# Altium project DH_Electronics.PrjPcb
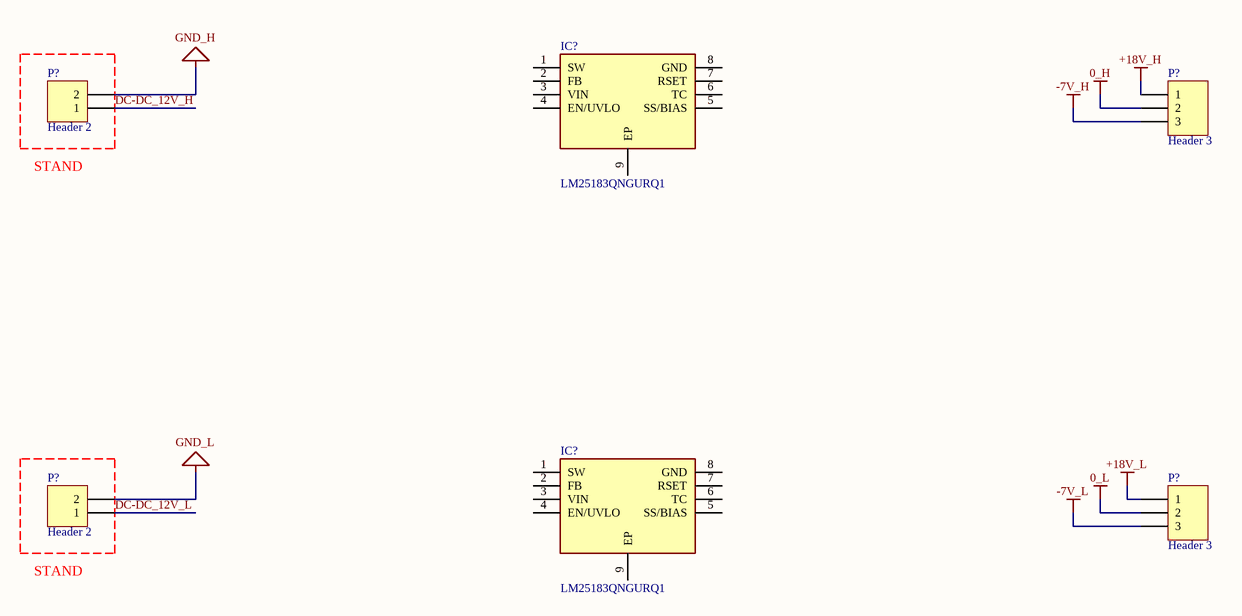
[diagram p0: Isolated_Gate_DCDC.SchDoc]
7 sheets, 147 parts. Net scope: flat (ports and power ports of the same name join across sheets).
Sheets:
  LV_ACDC_Converter.SchDoc
  Isolated_Gate_DCDC.SchDoc
  Gate_Drive.SchDoc
  Control_Unit.SchDoc
  Inteligent_IGBT.SchDoc
  HV_Bus.SchDoc
  Phase_Capacitor.SchDoc

## Sheet LV_ACDC_Converter.SchDoc
size A3

## Sheet Isolated_Gate_DCDC.SchDoc
size A3

### Parts
(Parts that share a designator on the sheet are numbered #1, #2 ... from top to bottom, then left to right.)
IC?#1  LM25183QNGURQ1  [SON80P400X400X80-9N]
IC?#2  LM25183QNGURQ1  [SON80P400X400X80-9N]
P?#1  Header 3  [HDR1X3]
P?#2  Header 2  [HDR1X2]
P?#3  Header 3  [HDR1X3]
P?#4  Header 2  [HDR1X2]

### Nets
0_H: P?#1.2  [project net H_EMITTER]
0_L: P?#3.2  [project net L_EMITTER]
+18V_H: P?#1.1
+18V_L: P?#3.1
-7V_H: P?#1.3
-7V_L: P?#3.3
GND_H: P?#2.2
GND_L: P?#4.2
DC-DC_12V_H: P?#2.1
DC-DC_12V_L: P?#4.1

Not connected (* = marked no-connect by the designer): IC?#1 1(SW) 2(FB) 3(VIN) 4(EN/UVLO) 5(SS/BIAS) 6(TC) 7(RSET) 8(GND) 9(EP); IC?#2 1(SW) 2(FB) 3(VIN) 4(EN/UVLO) 5(SS/BIAS) 6(TC) 7(RSET) 8(GND) 9(EP)

### Notes on the sheet
- STAND

### Library data of the parts
IC?#1 IC?#2 = LM25183QNGURQ1: Integrated Circuit; Manufacturer_Name: Texas Instruments; Datasheet Link: https://www.ti.com/lit/ds/symlink/lm25183-q1.pdf?ts=1601923557129&ref_url=https%253A%252F%252Fwww.ti.com%252Fstore%252Fti%252Fen%252Fp%252Fproduct%252F%253Fp%253DLM25183QNGURQ1%2526keyMatch%253DLM25183QNGURQ1%2526tisearch%253DSearch-EN-everything%2526usec; Height: 0.8mm; Manufacturer_Part_Number: LM25183QNGURQ1
P?#1 P?#3 = Header 3: Header, 3-Pin; LatestRevisionDate: 17-Jul-2002; LatestRevisionNote: Re-released for DXP Platform.; Publisher: Altium Limited
P?#2 P?#4 = Header 2: Header, 2-Pin; LatestRevisionDate: 17-Jul-2002; LatestRevisionNote: Re-released for DXP Platform.; Publisher: Altium Limited

## Sheet Gate_Drive.SchDoc
size A2; DrawnBy: Novikov M.I.
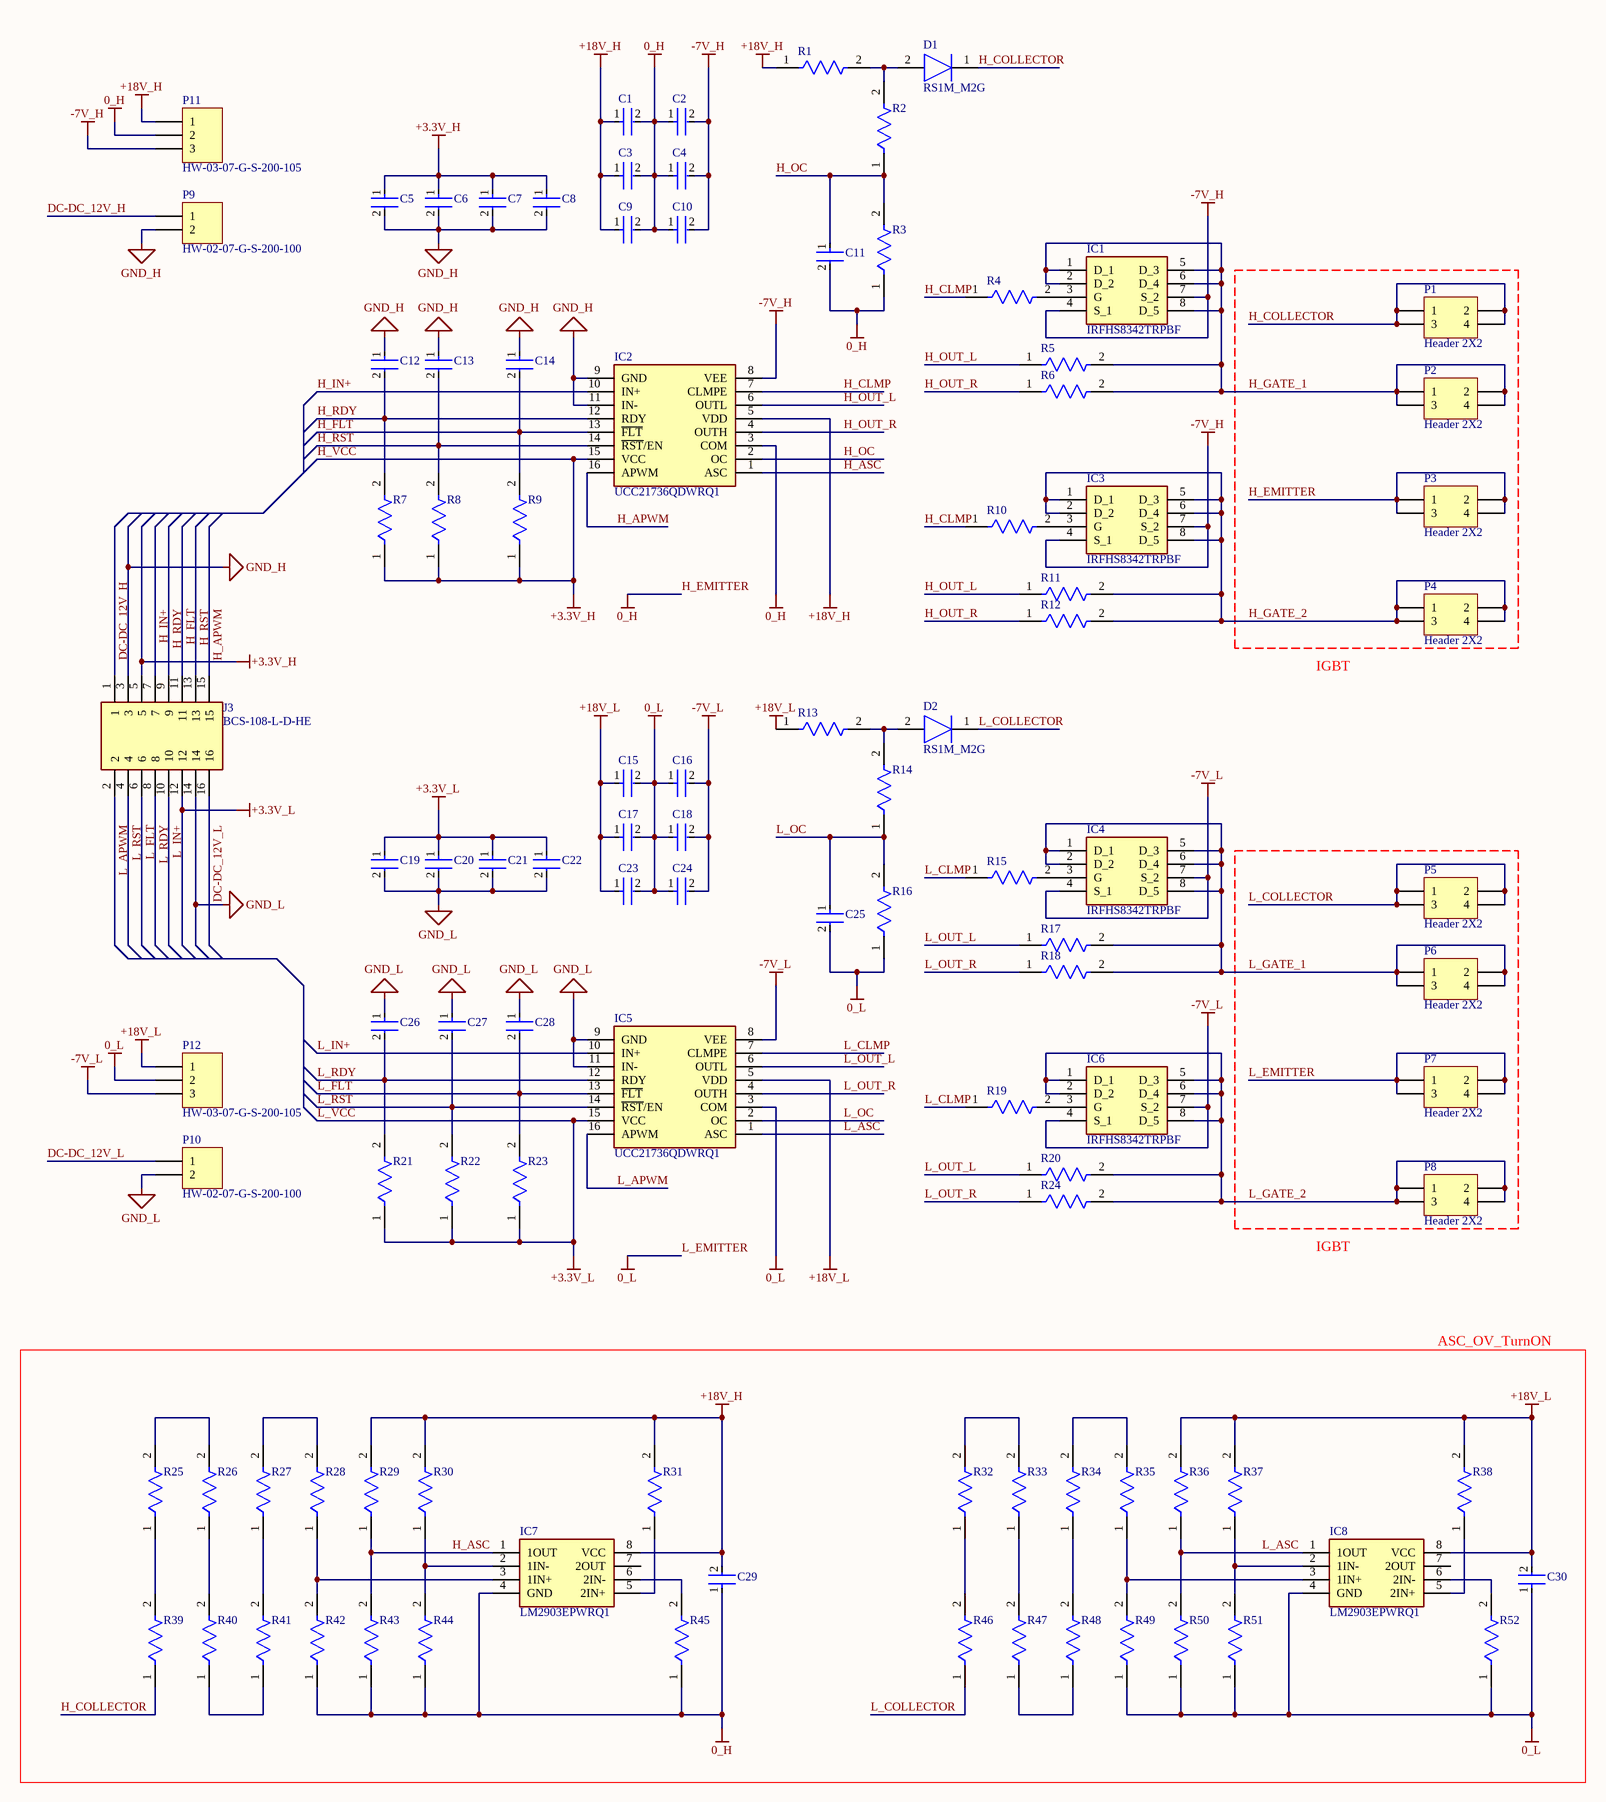
[diagram p1: Gate_Drive.SchDoc]

### Parts
(Parts that share a designator on the sheet are numbered #1, #2 ... from top to bottom, then left to right.)
C1#1  CGA5L2NP01H104J160AA  [FP-CGA5L-0_3-0_1-IPC_B]  (value not drawn)
C2#1  CGA5L2NP01H104J160AA  [FP-CGA5L-0_3-0_1-IPC_B]  (value not drawn)
C3#1  CGA6P1X8R1E106K250AC  [FP-CGA6P-IPC_B]  (value not drawn)
C4#1  CGA6P1X8R1E106K250AC  [FP-CGA6P-IPC_B]  (value not drawn)
C5  GCJ21BL81E105KA01L  [FP-GCJ21B-0_3-IPC_B]  (value not drawn)
C6  GCJ21BL81E105KA01L  [FP-GCJ21B-0_3-IPC_B]  (value not drawn)
C7  GCJ21BL81H104KA01L  [FP-GCJ21B-0_3-IPC_B]  (value not drawn)
C8  GCJ21BL81H104KA01L  [FP-GCJ21B-0_3-IPC_B]  (value not drawn)
C9  CGA6P1X8R1E106K250AC  [FP-CGA6P-IPC_B]  (value not drawn)
C10  CGA6P1X8R1E106K250AC  [FP-CGA6P-IPC_B]  (value not drawn)
C11  CGA4C4NP02W122J060AA  [FP-CGA4J-IPC_B]  (value not drawn)
C12  C0805C101J5HACAUTO  [FP-C0805C-DN-IPC_B]  (value not drawn)
C13  C0805C101J5HACAUTO  [FP-C0805C-DN-IPC_B]  (value not drawn)
C14  C0805C101J5HACAUTO  [FP-C0805C-DN-IPC_B]  (value not drawn)
C15  CGA5L2NP01H104J160AA  [FP-CGA5L-0_3-0_1-IPC_B]  (value not drawn)
C16  CGA5L2NP01H104J160AA  [FP-CGA5L-0_3-0_1-IPC_B]  (value not drawn)
C17  CGA6P1X8R1E106K250AC  [FP-CGA6P-IPC_B]  (value not drawn)
C18  CGA6P1X8R1E106K250AC  [FP-CGA6P-IPC_B]  (value not drawn)
C19  GCJ21BL81E105KA01L  [FP-GCJ21B-0_3-IPC_B]  (value not drawn)
C20  GCJ21BL81E105KA01L  [FP-GCJ21B-0_3-IPC_B]  (value not drawn)
C21  GCJ21BL81H104KA01L  [FP-GCJ21B-0_3-IPC_B]  (value not drawn)
C22  GCJ21BL81H104KA01L  [FP-GCJ21B-0_3-IPC_B]  (value not drawn)
C23  CGA6P1X8R1E106K250AC  [FP-CGA6P-IPC_B]  (value not drawn)
C24  CGA6P1X8R1E106K250AC  [FP-CGA6P-IPC_B]  (value not drawn)
C25  CGA4C4NP02W122J060AA  [FP-CGA4J-IPC_B]  (value not drawn)
C26  C0805C101J5HACAUTO  [FP-C0805C-DN-IPC_B]  (value not drawn)
C27  C0805C101J5HACAUTO  [FP-C0805C-DN-IPC_B]  (value not drawn)
C28  C0805C101J5HACAUTO  [FP-C0805C-DN-IPC_B]  (value not drawn)
C29  CGA5L2NP01H104J160AA  [FP-CGA5L-0_3-0_1-IPC_B]  (value not drawn)
C30  CGA5L2NP01H104J160AA  [FP-CGA5L-0_3-0_1-IPC_B]  (value not drawn)
D1  RS1M_M2G  [DIOM5126X250N]
D2  RS1M_M2G  [DIOM5126X250N]
IC1  IRFHS8342TRPBF  [PQFN(2X2)]
IC2  UCC21736QDWRQ1  [SOIC127P1030X265-16N]
IC3  IRFHS8342TRPBF  [PQFN(2X2)]
IC4  IRFHS8342TRPBF  [PQFN(2X2)]
IC5  UCC21736QDWRQ1  [SOIC127P1030X265-16N]
IC6  IRFHS8342TRPBF  [PQFN(2X2)]
IC7  LM2903EPWRQ1  [SOP65P640X120-8N]
IC8  LM2903EPWRQ1  [SOP65P640X120-8N]
J3#1  BCS-108-L-D-HE  [BCS-108-L-D-HE]
P1  Header 2X2  [HDR2X2]
P2  Header 2X2  [HDR2X2]
P3  Header 2X2  [HDR2X2]
P4  Header 2X2  [HDR2X2]
P5  Header 2X2  [HDR2X2]
P6  Header 2X2  [HDR2X2]
P7  Header 2X2  [HDR2X2]
P8  Header 2X2  [HDR2X2]
P9  HW-02-07-G-S-200-100  [PCBComponent_1]
P10  HW-02-07-G-S-200-100  [PCBComponent_1]
P11  HW-03-07-G-S-200-105  [PCBComponent_1]
P12  HW-03-07-G-S-200-105  [PCBComponent_1]
R1#1  CRCW08055K60FKEA  [FP-CRCW0805-e3-IPC_B]  (value not drawn)
R2#1  CRCW080510K0FKEA  [FP-CRCW0805-e3-IPC_B]  (value not drawn)
R3#1  CRCW08051K60JNEA  [FP-CRCW0805-e3-IPC_B]  (value not drawn)
R4#1  CRCW080522R0FKEA  [FP-CRCW0805-e3-IPC_C]  (value not drawn)
R5#1  CRCW25124R70JNEG  [FP-CRCW2512-e3-IPC_B]  (value not drawn)
R6#1  CRCW25124R30JNEG  [FP-CRCW2512-e3-IPC_B]  (value not drawn)
R7#1  CRCW08055K60FKEA  [FP-CRCW0805-e3-IPC_B]  (value not drawn)
R8#1  CRCW08055K60FKEA  [FP-CRCW0805-e3-IPC_B]  (value not drawn)
R9  CRCW08055K60FKEA  [FP-CRCW0805-e3-IPC_B]  (value not drawn)
R10  CRCW080522R0FKEA  [FP-CRCW0805-e3-IPC_C]  (value not drawn)
R11  CRCW25124R70JNEG  [FP-CRCW2512-e3-IPC_B]  (value not drawn)
R12  CRCW25124R30JNEG  [FP-CRCW2512-e3-IPC_B]  (value not drawn)
R13  CRCW08055K60FKEA  [FP-CRCW0805-e3-IPC_B]  (value not drawn)
R14  CRCW080510K0FKEA  [FP-CRCW0805-e3-IPC_B]  (value not drawn)
R15  CRCW080522R0FKEA  [FP-CRCW0805-e3-IPC_C]  (value not drawn)
R16  CRCW08051K60JNEA  [FP-CRCW0805-e3-IPC_B]  (value not drawn)
R17  CRCW25124R70JNEG  [FP-CRCW2512-e3-IPC_B]  (value not drawn)
R18  CRCW25124R30JNEG  [FP-CRCW2512-e3-IPC_B]  (value not drawn)
R19  CRCW080522R0FKEA  [FP-CRCW0805-e3-IPC_C]  (value not drawn)
R20  CRCW25124R70JNEG  [FP-CRCW2512-e3-IPC_B]  (value not drawn)
R21  CRCW08055K60FKEA  [FP-CRCW0805-e3-IPC_B]  (value not drawn)
R22  CRCW08055K60FKEA  [FP-CRCW0805-e3-IPC_B]  (value not drawn)
R23  CRCW08055K60FKEA  [FP-CRCW0805-e3-IPC_B]  (value not drawn)
R24  CRCW25124R30JNEG  [FP-CRCW2512-e3-IPC_B]  (value not drawn)
R25  RT0805BRD07200KL  [FP-RT0805-IPC_B]  (value not drawn)
R26  RT0805BRD07200KL  [FP-RT0805-IPC_B]  (value not drawn)
R27  RT0805BRD07200KL  [FP-RT0805-IPC_B]  (value not drawn)
R28  RT0805BRD07200KL  [FP-RT0805-IPC_B]  (value not drawn)
R29  CRCW080510K0FKEA  [FP-CRCW0805-e3-IPC_B]  (value not drawn)
R30  CRCW080510K0FKEA  [FP-CRCW0805-e3-IPC_B]  (value not drawn)
R31  CRCW080510K0FKEA  [FP-CRCW0805-e3-IPC_B]  (value not drawn)
R32  RT0805BRD07200KL  [FP-RT0805-IPC_B]  (value not drawn)
R33  RT0805BRD07200KL  [FP-RT0805-IPC_B]  (value not drawn)
R34  RT0805BRD07200KL  [FP-RT0805-IPC_B]  (value not drawn)
R35  RT0805BRD07200KL  [FP-RT0805-IPC_B]  (value not drawn)
R36  CRCW080510K0FKEA  [FP-CRCW0805-e3-IPC_B]  (value not drawn)
R37  CRCW080510K0FKEA  [FP-CRCW0805-e3-IPC_B]  (value not drawn)
R38  CRCW080510K0FKEA  [FP-CRCW0805-e3-IPC_B]  (value not drawn)
R39  RT0805BRD07200KL  [FP-RT0805-IPC_B]  (value not drawn)
R40  RT0805BRD07200KL  [FP-RT0805-IPC_B]  (value not drawn)
R41  RT0805BRD07200KL  [FP-RT0805-IPC_B]  (value not drawn)
R42  CRCW080510K0FKEA  [FP-CRCW0805-e3-IPC_B]  (value not drawn)
R43  CRCW08055K60FKEA  [FP-CRCW0805-e3-IPC_B]  (value not drawn)
R44  CRCW08055K60FKEA  [FP-CRCW0805-e3-IPC_B]  (value not drawn)
R45  CRCW080510K0FKEA  [FP-CRCW0805-e3-IPC_B]  (value not drawn)
R46  RT0805BRD07200KL  [FP-RT0805-IPC_B]  (value not drawn)
R47  RT0805BRD07200KL  [FP-RT0805-IPC_B]  (value not drawn)
R48  RT0805BRD07200KL  [FP-RT0805-IPC_B]  (value not drawn)
R49  CRCW080510K0FKEA  [FP-CRCW0805-e3-IPC_B]  (value not drawn)
R50  CRCW08055K60FKEA  [FP-CRCW0805-e3-IPC_B]  (value not drawn)
R51  CRCW08055K60FKEA  [FP-CRCW0805-e3-IPC_B]  (value not drawn)
R52  CRCW080510K0FKEA  [FP-CRCW0805-e3-IPC_B]  (value not drawn)

### Blocks framed on the sheet
ASC_OV_TurnON: C29 C30 IC7 IC8 R25-R52

### Nets
+18V_H: C1#1.1 C3#1.1 C9.1 C29.2 IC2.5(VDD) IC7.8(VCC) P11.1 R1#1.1 R29.2 R30.2 R31.2
+18V_L: C15.1 C17.1 C23.1 C30.2 IC5.5(VDD) IC8.8(VCC) P12.1 R13.1 R36.2 R37.2 R38.2
-7V_H: C2#1.2 C4#1.2 C10.2 IC1.4(S_1) IC1.7(S_2) IC2.8(VEE) IC3.4(S_1) IC3.7(S_2) P11.3
-7V_L: C16.2 C18.2 C24.2 IC4.4(S_1) IC4.7(S_2) IC5.8(VEE) IC6.4(S_1) IC6.7(S_2) P12.3
GND_H: C5.2 C6.2 C7.2 C8.2 C12.1 C13.1 C14.1 IC2.9(GND) IC2.11(IN-) J3#1.3 P9.2
GND_L: C19.2 C20.2 C21.2 C22.2 C26.1 C27.1 C28.1 IC5.9(GND) IC5.11(IN-) J3#1.14 P10.2
H_EMITTER: C1#1.2 C2#1.1 C3#1.2 C4#1.1 C9.2 C10.1 C11.2 C29.1 IC2.3(COM) IC7.4(GND) P3.1 P3.2 P3.3 P3.4 P11.2 R3#1.1 R42.1 R43.1 R44.1 R45.1  [also labelled 0_H]
H_VCC: C5.1 C6.1 C7.1 C8.1 C19.1 C20.1 C21.1 C22.1 IC2.15(VCC) IC5.15(VCC) J3#1.5 J3#1.12 R7#1.1 R8#1.1 R9.1 R21.1 R22.1 R23.1  [also labelled +3.3V_H, +3.3V_L, L_VCC]
L_EMITTER: C15.2 C16.1 C17.2 C18.1 C23.2 C24.1 C25.2 C30.1 IC5.3(COM) IC8.4(GND) P7.1 P7.2 P7.3 P7.4 P12.2 R16.1 R49.1 R50.1 R51.1 R52.1  [also labelled 0_L]
DC-DC_12V_H: J3#1.1 P9.1
DC-DC_12V_L: J3#1.16 P10.1
H_APWM: IC2.16(APWM) J3#1.15
H_ASC: IC2.1(ASC) IC7.1(1OUT) R29.1 R43.2
H_CLMP: IC2.7(CLMPE) R4#1.1 R10.1
H_COLLECTOR: D1.1(K) P1.1 P1.2 P1.3 P1.4 R39.1
H_FLT: C14.2 IC2.13(~{FLT}) J3#1.11 R9.2
H_GATE_1: IC1.1(D_1) IC1.2(D_2) IC1.5(D_3) IC1.6(D_4) IC1.8(D_5) P2.1 P2.2 P2.3 P2.4 R5#1.2 R6#1.2
H_GATE_2: IC3.1(D_1) IC3.2(D_2) IC3.5(D_3) IC3.6(D_4) IC3.8(D_5) P4.1 P4.2 P4.3 P4.4 R11.2 R12.2
H_IN+: IC2.10(IN+) J3#1.7
H_OC: C11.1 IC2.2(OC) R2#1.1 R3#1.2
H_OUT_L: IC2.6(OUTL) R5#1.1 R11.1
H_OUT_R: IC2.4(OUTH) R6#1.1 R12.1
H_RDY: C12.2 IC2.12(RDY) J3#1.9 R7#1.2
H_RST: C13.2 IC2.14(~{RST}/EN) J3#1.13 R8#1.2
L_APWM: IC5.16(APWM) J3#1.2
L_ASC: IC5.1(ASC) IC8.1(1OUT) R36.1 R50.2
L_CLMP: IC5.7(CLMPE) R15.1 R19.1
L_COLLECTOR: D2.1(K) P5.1 P5.2 P5.3 P5.4 R46.1
L_FLT: C28.2 IC5.13(~{FLT}) J3#1.6 R23.2
L_GATE_1: IC4.1(D_1) IC4.2(D_2) IC4.5(D_3) IC4.6(D_4) IC4.8(D_5) P6.1 P6.2 P6.3 P6.4 R17.2 R18.2
L_GATE_2: IC6.1(D_1) IC6.2(D_2) IC6.5(D_3) IC6.6(D_4) IC6.8(D_5) P8.1 P8.2 P8.3 P8.4 R20.2 R24.2
L_IN+: IC5.10(IN+) J3#1.10
L_OC: C25.1 IC5.2(OC) R14.1 R16.2
L_OUT_L: IC5.6(OUTL) R17.1 R20.1
L_OUT_R: IC5.4(OUTH) R18.1 R24.1
L_RDY: C26.2 IC5.12(RDY) J3#1.8 R21.2
L_RST: C27.2 IC5.14(~{RST}/EN) J3#1.4 R22.2
NetD1_2: D1.2(A) R1#1.2 R2#1.2
NetD2_2: D2.2(A) R13.2 R14.2
NetIC1_3: IC1.3(G) R4#1.2
NetIC3_3: IC3.3(G) R10.2
NetIC4_3: IC4.3(G) R15.2
NetIC6_3: IC6.3(G) R19.2
NetIC7_2: IC7.2(1IN-) R30.1 R44.2
NetIC7_3: IC7.3(1IN+) R28.1 R42.2
NetIC7_5: IC7.5(2IN+) R31.1
NetIC7_6: IC7.6(2IN-) R45.2
NetIC8_2: IC8.2(1IN-) R37.1 R51.2
NetIC8_3: IC8.3(1IN+) R35.1 R49.2
NetIC8_5: IC8.5(2IN+) R38.1
NetIC8_6: IC8.6(2IN-) R52.2
NetR25_1: R25.1 R39.2
NetR25_2: R25.2 R26.2
NetR26_1: R26.1 R40.2
NetR27_1: R27.1 R41.2
NetR27_2: R27.2 R28.2
NetR32_1: R32.1 R46.2
NetR32_2: R32.2 R33.2
NetR33_1: R33.1 R47.2
NetR34_1: R34.1 R48.2
NetR34_2: R34.2 R35.2
NetR40_1: R40.1 R41.1
NetR47_1: R47.1 R48.1

Not connected (* = marked no-connect by the designer): IC7 7(2OUT); IC8 7(2OUT)

### Notes on the sheet
- IGBT

### Library data of the parts
C1#1 C2#1 C15 C16 C29 C30 = CMP-08246-000628-1: Cap Ceramic 100nF 50V NP0 5% Pad SMD 1206 +150°C Automotive T/R; Voltage Rating: 50V; Packaging: Tape and Reel; Features: High Temperature; Package Quantity: 2000; Case Code (Metric): 3216; Min Operating Temperature: -55°C; Case/Package: 1206; Tolerance: 5%; Width: 0.063inch; Ratings: AEC-Q200; Thickness: 0.071inch; Mount: Surface Mount; Length: 0.126inch; Capacitance: 100nF; Case Code (Imperial): 1206; Max Operating Temperature: 150°C
C3#1 C4#1 C9 C10 C17 C18 C23 C24 = CMP-08246-001494-1: Cap Ceramic 10uF 25V X8R 10% Pad SMD 1210 +150°C Automotive T/R; Packaging: Cut Tape; Features: High Temperature; Case Code (Imperial): 1210; Voltage Rating: 25V; Mount: Surface Mount; Ratings: AEC-Q200; Case/Package: 1210; Case Code (Metric): 3225; Max Operating Temperature: 150°C; Capacitance: 10uF; Tolerance: 10%; Min Operating Temperature: -55°C
C5 C6 C19 C20 = CMP-06035-029661-1: Multilayer Ceramic Capacitors MLCC - SMD/SMT 0805 1uF 10%, 25VDC,  X8L +15/-40%; Voltage Rating: 25V; Max Operating Temperature: 150°C; Case Code (Metric): 2012; Case/Package: 0805; Features: Soft Termination; Min Operating Temperature: -55°C; Capacitance: 1uF; Packaging: Tape and Reel; Case Code (Imperial): 0805; Ratings: AEC-Q200; Mount: Surface Mount; Tolerance: 10%
C7 C8 C21 C22 = CMP-06035-032475-1: Multilayer Ceramic Capacitors MLCC - SMD/SMT 0805 0.1uF 10%, 50VDC,  X8L +15/-40%; Capacitance: 100nF; Voltage Rating: 50V; Max Operating Temperature: 150°C; Packaging: Tape and Reel; Tolerance: 10%; Case Code (Imperial): 0805; Mount: Surface Mount; Case Code (Metric): 2012; Ratings: AEC-Q200; Case/Package: 0805; Features: Soft Termination; Min Operating Temperature: -55°C
C11 C25 = CMP-08246-000791-1: Cap Ceramic 1.2nF 450V NP0 5% Pad SMD 0805 +150°C Automotive T/R; Dielectric: C0G; Capacitance: 1.2nF; Lead Free: Lead Free; Case/Package: 0805; Weight: 0.000194oz; Features: High Temperature; Min Operating Temperature: -55°C; Tolerance: 5%; Termination: SMD/SMT; Packaging: Tape and Reel; Thickness: 0.03inch; Voltage Rating (DC): 450V; Voltage Rating: 450V; Width: 0.049inch; Height: 0.6mm; Case Code (Metric): 2012; Composition: Ceramic; Ratings: AEC-Q200; Package Quantity: 4000; Mount: Surface Mount; Case Code (Imperial): 0805; Max Operating Temperature: 150°C; Length: 0.079inch
C12-C14 C26-C28 = CMP-03020-020342-1: CAP CER 0805 100PF 50V ULTRA STA; Manufacturer: KEMET; Temperature Characteristic: X8R; Material: Ceramic; Temperature Coefficient: 30ppm/°C; Tolerance: 0.05; Temperature Range High: +125°C; RoHS: TRUE; Temperature: -55°C to +125°C; Device Class L3: Ceramic Capacitors; ComponentLink2URL: https://content.kemet.com/datasheets/KEM_C1003_C0G_SMD.pdf; Package: C0805C-DN; Lead Free: Yes; Automotive: No; Voltage Rating: 50 V; Capacitance: 100 pF; Device Class L2: Capacitors; Digikey Description: CAP CER 0805 100PF 50V ULTRA STA; Mouser Description: Cap Ceramic 100pF 50V X8R 5% Pad SMD 0805 150C Automotive T/R; Ipc Land Pattern Name: CAPC200125X78; Temperature Range Low: -55°C; Device Class L1: Passive Components; ComponentLink2Description: Datasheet; Octopart: https://octopart.com/c0805c101j5hacauto-kemet-87698063; Category: Cap; Value: 100 pF; Height: 0.88mm; Manufacturer Part Number: C0805C101J5HACAUTO
D1 D2 = RS1M_M2G: Diode; Manufacturer_Name: Taiwan Semiconductor; Manufacturer_Part_Number: RS1M M2G; Datasheet Link: http://www.mouser.com/datasheet/2/395/RS1A SERIES_K15-1113611.pdf; Height: 2.5mm; Mouser Part Number: 821-RS1MM2G; Mouser Price/Stock: https://www.mouser.com/Search/Refine.aspx?Keyword=821-RS1MM2G; Arrow Part Number: RS1M M2G; Arrow Price/Stock: https://www.arrow.com/en/products/rs1m-m2g/taiwan-semiconductor
IC1 IC3 IC4 IC6 = IRFHS8342TRPBF: Integrated Circuit; Manufacturer_Name: Infineon; Datasheet Link: https://componentsearchengine.com/Datasheets/1/IRFHS8342TRPBF.pdf; Manufacturer_Part_Number: IRFHS8342TRPBF; Mouser Part Number: 942-IRFHS8342TRPBF; Mouser Price/Stock: https://www.mouser.co.uk/ProductDetail/Infineon-IR/IRFHS8342TRPBF?qs=Z8%252BeY1k3TILJK9l3AOTdfA%3D%3D; Arrow Part Number: IRFHS8342TRPBF; Arrow Price/Stock: https://www.arrow.com/en/products/irfhs8342trpbf/infineon-technologies-ag
IC2 IC5 = UCC21736QDWRQ1: Integrated Circuit; Manufacturer_Name: Texas Instruments; Datasheet Link: https://www.ti.com/lit/ds/symlink/ucc21736-q1.pdf?ts=1610170637293&ref_url=https%253A%252F%252Feu.mouser.com%252F; Height: 2.65mm; Manufacturer_Part_Number: UCC21736QDWRQ1; Mouser Part Number: 595-UCC21736QDWRQ1; Mouser Price/Stock: https://www.mouser.co.uk/ProductDetail/Texas-Instruments/UCC21736QDWRQ1/?qs=xZ%2FP%252Ba9zWqazxpYJ%2Flne3g%3D%3D
IC7 IC8 = LM2903EPWRQ1: Integrated Circuit; Manufacturer_Name: Texas Instruments; Datasheet Link: http://www.ti.com/lit/gpn/LM2903-Q1; Height: 1.2mm; Manufacturer_Part_Number: LM2903EPWRQ1; Mouser Part Number: 595-LM2903EPWRQ1; Mouser Price/Stock: https://www.mouser.co.uk/ProductDetail/Texas-Instruments/LM2903EPWRQ1/?qs=gTYE2QTfZfSOOljfli3%2Fvg%3D%3D; Arrow Part Number: LM2903EPWRQ1; Arrow Price/Stock: https://www.arrow.com/en/products/lm2903epwrq1/texas-instruments
J3#1 = BCS-108-L-D-HE: Connector; Manufacturer_Name: SAMTEC; Datasheet Link: http://suddendocs.samtec.com/prints/bcs-1xx-xxx-x-xx-xxx-mkt.pdf; Manufacturer_Part_Number: BCS-108-L-D-HE; System: Connector
P1-P8 = Header 2X2: Header, 2-Pin, Dual row; System: Connector; LatestRevisionDate: 17-Jul-2002; LatestRevisionNote: Re-released for DXP Platform.; Publisher: Altium Limited
P9 P10 = Header 2: Header, 2-Pin; System: Connector; LatestRevisionDate: 17-Jul-2002; LatestRevisionNote: Re-released for DXP Platform.; Publisher: Altium Limited
P11 P12 = Header 3: Header, 3-Pin; System: Connector; LatestRevisionDate: 17-Jul-2002; LatestRevisionNote: Re-released for DXP Platform.; Publisher: Altium Limited
  P11: Parameter 1: *
R1#1 R7#1 R8#1 R9 R13 R21-R23 R43 R44 R50 R51 = CMP-2001-04030-2: RES Thick Film, 5.6kΩ, 1%, 0.125W, 100ppm/°C, 0805; Resistance: 5.6kR; Voltage Rating: 150V; Max Power Dissipation: 125mW; Case Code (Imperial): 0805; Features: Automotive AEC-Q200; Composition: Thick Film; Package Quantity: 1; Mount: Surface Mount; Tolerance: 1%; Radiation Hardening: No; Length: 2mm; Case Code (Metric): 2012; Temperature Coefficient: 100ppm/°C; Power Rating: 125mW; Number of Terminations: 2; Lead Free: Lead Free; Voltage Rating (DC): 150V; Military Standard: Not; Number of Pins: 2; Height: 0.45mm; Depth: 1.25mm; Weight: 0.000194oz; Packaging: Tape and Reel; Case/Package: 0805; Contact Plating: Tin; Min Operating Temperature: -55°C; Termination: SMD/SMT; Max Operating Temperature: 155°C; Width: 1.25mm
R2#1 R14 R29-R31 R36-R38 R42 R45 R49 R52 = CMP-2001-04908-2: RES Thick Film, 10kΩ, 1%, 0.125W, 100ppm/°C, 0805; Resistance: 10kR; Voltage Rating (DC): 150V; Power Rating: 125mW; Weight: 0.000194oz; Package Quantity: 5000; Military Standard: Not; Max Operating Temperature: 155°C; Temperature Coefficient: 100ppm/°C; Contact Plating: Tin; Width: 1.25mm; Height: 0.45mm; Radiation Hardening: No; Tolerance: 1%; Min Operating Temperature: -55°C; Voltage Rating: 150V; Length: 2mm; Depth: 1.25mm; Termination: SMD/SMT; Packaging: Tape and Reel; Case/Package: 0805; Case Code (Metric): 2012; Lead Free: Lead Free; Case Code (Imperial): 0805; Composition: Thick Film
R3#1 R16 = CMP-1013-00079-3: RES Thick Film, 1.6kΩ, 5%, 0.125W, 200ppm/°C, 0805; Max Power Dissipation: 125mW; Resistance: 1.6kR; Voltage Rating (DC): 150V; Case Code (Metric): 2012; Max Operating Temperature: 155°C; Min Operating Temperature: -55°C; Packaging: Tape and Reel; Width: 0.049inch; Package Quantity: 1; Temperature Coefficient: 200ppm/°C; Lead Free: Lead Free; Case Code (Imperial): 0805; Contact Plating: Tin; Tolerance: 5%; Radiation Hardening: No; Depth: 1.25mm; Power Rating: 125mW; Case/Package: 0805; Voltage Rating: 150V; Length: 2mm; Features: Automotive AEC-Q200; Composition: Thick Film; Weight: 0.000194oz; Number of Terminations: 2; Height: 0.02inch; Military Standard: Not
R4#1 R10 R15 R19 = CMP-2001-03692-2: RES Thick Film, 22Ω, 1%, 0.125W, 100ppm/°C, 0805; Resistance: 22R; Power Rating: 125mW; Voltage Rating: 150V; Case/Package: 0805; Radiation Hardening: No; Number of Terminations: 2; Termination: SMD/SMT; Package Quantity: 5000; Weight: 0.000194oz; Mount: Surface Mount; Lead Free: Lead Free; Height: 0.45mm; Composition: Thick Film; Min Operating Temperature: -55°C; Case Code (Metric): 2012; Temperature Coefficient: 100ppm/°C; Depth: 1.25mm; Packaging: Tape and Reel; Contact Plating: Tin; Width: 1.25mm; Case Code (Imperial): 0805; Length: 2mm; Max Operating Temperature: 155°C; Tolerance: 1%; Features: Automotive AEC-Q200; Military Standard: Not; Voltage Rating (DC): 150V; Max Power Dissipation: 125mW
R5#1 R11 R17 R20 = CMP-1018-00018-2: RES Thick Film, 4.7Ω, 5%, 1W, 200ppm/°C, 2512; Voltage Rating: 500V; Resistance: 4.7R; Composition: Thick Film; Temperature Coefficient: 200ppm/°C; Number of Terminations: 2; Contact Plating: Tin; Lead Free: Lead Free; Length: 6.3mm; Termination: SMD/SMT; Weight: 0.001429oz; Width: 3.15mm; Features: Automotive AEC-Q200; Case/Package: 2512; Power Rating: 1W; Min Operating Temperature: -55°C; Radiation Hardening: No; Depth: 3.15mm; Case Code (Metric): 6432; Number of Pins: 2; Mount: Surface Mount; Tolerance: 5%; Military Standard: Not; Height: 0.6mm; Max Power Dissipation: 1W; Max Operating Temperature: 155°C; Voltage Rating (DC): 500V; Package Quantity: 2000; Packaging: Tape and Reel; Case Code (Imperial): 2512
R6#1 R12 R18 R24 = CMP-1018-00017-2: RES Thick Film, 4.3Ω, 5%, 1W, 200ppm/°C, 2512; Resistance: 4.3R; Voltage Rating: 500V; Min Operating Temperature: -55°C; Max Power Dissipation: 1W; Number of Terminations: 2; Contact Plating: Tin; Termination: SMD/SMT; Package Quantity: 2000; Tolerance: 5%; Max Operating Temperature: 155°C; Lead Free: Lead Free; Weight: 0.001429oz; Composition: Thick Film; Temperature Coefficient: 200ppm/°C; Case Code (Imperial): 2512; Length: 6.3mm; Number of Pins: 2; Power Rating: 1W; Width: 0.124inch; Radiation Hardening: No; Case/Package: 2512; Features: Automotive AEC-Q200; Height: 0.028inch; Military Standard: Not; Depth: 3.15mm; Case Code (Metric): 6432; Packaging: Tape and Reel; Voltage Rating (DC): 500V
R25-R28 R32-R35 R39-R41 R46-R48 = CMP-2001-01722-2: RES SMD 200K OHM 0.1% 1/8W 0805; Manufacturer: Yageo; Voltage Rating: 150V; Resistance: 200KΩ; Power Rating: 0.125W; Value: 200KΩ; Tolerance: 0.0025; Temperature Coefficient: 25 ppm/°C; Automotive: No; Manufacturer Part Number: RT0805BRD07200KL; Package: RT0805; RoHS: TRUE; Ipc Land Pattern Name: RESC200125X50; Series: RT; Height: 0.6mm; Device Class L1: Passive Components; Footprint Url: http://www.yageo.com/exep/pages/download/literatures/PYu-R_Mount_10.pdf; Mouser Description: High Precision-High Stability Chip Resistor Thin Film 0805 200kOhm 0.1% Paper T/R; Composition: Thin Film; Temperature: -55°C to +155°C; Device Class L3: Chip SMD Resistors; Temperature Range Low: -55°C; Octopart: https://octopart.com/rt0805brd07200kl-yageo-1477199; Device Class L2: Resistors; Temperature Range High: +155°C; ComponentLink2Description: Datasheet; Category: Res; Lead Free: Yes; ComponentLink2URL: http://www.yageo.com/documents/recent/PYu-RT_1-to-0.01_RoHS_L_9.pdf; Digikey Description: RES SMD 200K OHM 0.1% 1/8W 0805

## Sheet Control_Unit.SchDoc
size A2
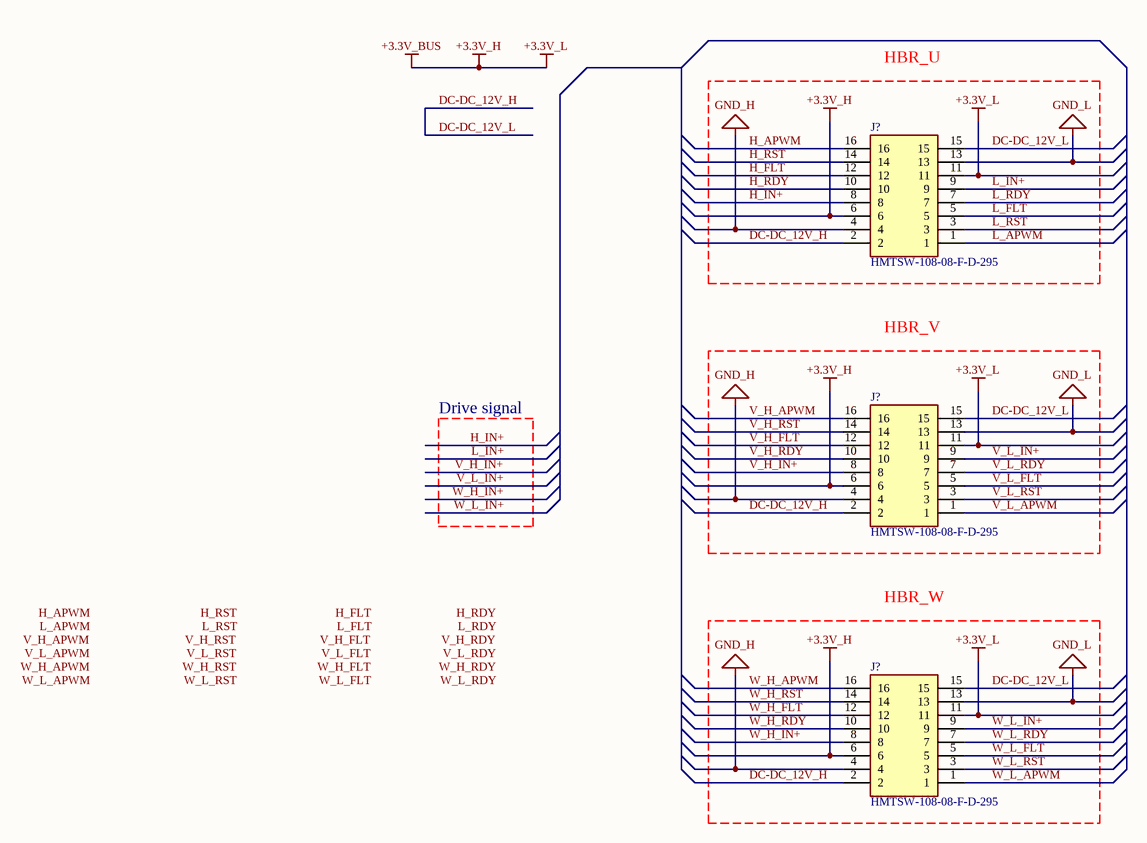
[diagram p2: Control_Unit.SchDoc]

### Parts
(Parts that share a designator on the sheet are numbered #1, #2 ... from top to bottom, then left to right.)
J?#1  HMTSW-108-08-F-D-295  [HDRV16W64P254_2X8_2032X502X1117P]
J?#2  HMTSW-108-08-F-D-295  [HDRV16W64P254_2X8_2032X502X1117P]
J?#3  HMTSW-108-08-F-D-295  [HDRV16W64P254_2X8_2032X502X1117P]

### Blocks framed on the sheet
HBR_U: J?#1
HBR_V: J?#2
HBR_W: J?#3

### Nets
+3.3V_BUS: J?#1.6 J?#1.11 J?#2.6 J?#2.11 J?#3.6 J?#3.11  [also labelled +3.3V_H, +3.3V_L]  [project net H_VCC]
GND_H: J?#1.4 J?#2.4 J?#3.4
GND_L: J?#1.13 J?#2.13 J?#3.13
DC-DC_12V_H: J?#1.2 J?#1.15 J?#2.2 J?#2.15 J?#3.2 J?#3.15  [also labelled DC-DC_12V_L]
H_APWM: J?#1.16
H_FLT: J?#1.12
H_IN+: J?#1.8
H_RDY: J?#1.10
H_RST: J?#1.14
L_APWM: J?#1.1
L_FLT: J?#1.5
L_IN+: J?#1.9
L_RDY: J?#1.7
L_RST: J?#1.3
V_H_APWM: J?#2.16
V_H_FLT: J?#2.12
V_H_IN+: J?#2.8
V_H_RDY: J?#2.10
V_H_RST: J?#2.14
V_L_APWM: J?#2.1
V_L_FLT: J?#2.5
V_L_IN+: J?#2.9
V_L_RDY: J?#2.7
V_L_RST: J?#2.3
W_H_APWM: J?#3.16
W_H_FLT: J?#3.12
W_H_IN+: J?#3.8
W_H_RDY: J?#3.10
W_H_RST: J?#3.14
W_L_APWM: J?#3.1
W_L_FLT: J?#3.5
W_L_IN+: J?#3.9
W_L_RDY: J?#3.7
W_L_RST: J?#3.3

### Notes on the sheet
- Drive signal
- Labels drawn without touching a wire or pin: H_APWM, H_FLT, H_RDY, H_RST, L_APWM, L_FLT, L_RDY, L_RST, V_H_APWM, V_H_FLT, V_H_RDY, V_H_RST, V_L_APWM, V_L_FLT, V_L_RDY, V_L_RST, W_H_APWM, W_H_FLT, W_H_RDY, W_H_RST, W_L_APWM, W_L_FLT, W_L_RDY, W_L_RST

### Library data of the parts
J?#1-J?#3 = HMTSW-108-08-F-D-295: Connector; Manufacturer_Name: SAMTEC; Datasheet Link: https://ru.mouser.com/datasheet/2/527/hmtsw-1370239.pdf; Height: 11.17mm; Manufacturer_Part_Number: HMTSW-108-08-F-D-295

## Sheet Inteligent_IGBT.SchDoc
size A4
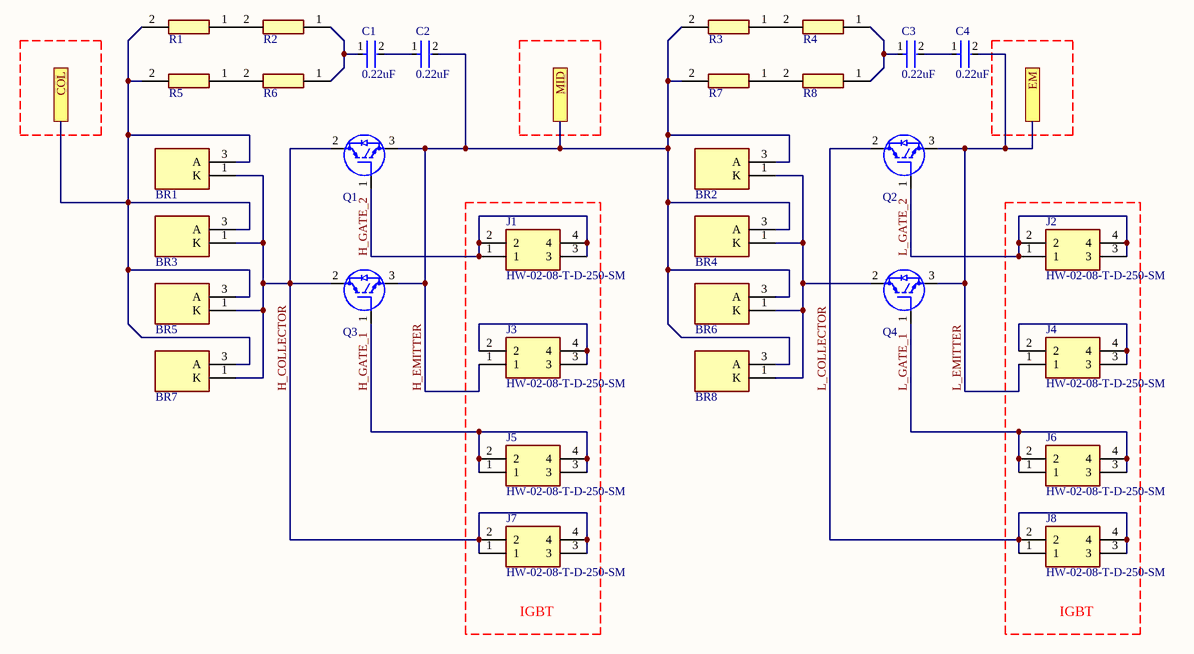
[diagram p3: Inteligent_IGBT.SchDoc]

### Parts
(Parts that share a designator on the sheet are numbered #1, #2 ... from top to bottom, then left to right.)
BR1  VS-75EPU12L-N3  [VS-75EPU12L-N3]  (value not drawn)
BR2  VS-75EPU12L-N3  [VS-75EPU12L-N3]  (value not drawn)
BR3  VS-75EPU12L-N3  [VS-75EPU12L-N3]  (value not drawn)
BR4  VS-75EPU12L-N3  [VS-75EPU12L-N3]  (value not drawn)
BR5  VS-75EPU12L-N3  [VS-75EPU12L-N3]  (value not drawn)
BR6  VS-75EPU12L-N3  [VS-75EPU12L-N3]  (value not drawn)
BR7  VS-75EPU12L-N3  [VS-75EPU12L-N3]  (value not drawn)
BR8  VS-75EPU12L-N3  [VS-75EPU12L-N3]  (value not drawn)
C1#2  0.22uF  [FP-CKC33C-IPC_A]
C2#2  0.22uF  [FP-CKC33C-IPC_A]
C3#2  0.22uF  [FP-CKC33C-IPC_A]
C4#2  0.22uF  [FP-CKC33C-IPC_A]
J1  HW-02-08-T-D-250-SM  [HW0208TD250SM]
J2  HW-02-08-T-D-250-SM  [HW0208TD250SM]
J3#2  HW-02-08-T-D-250-SM  [HW0208TD250SM]
J4  HW-02-08-T-D-250-SM  [HW0208TD250SM]
J5  HW-02-08-T-D-250-SM  [HW0208TD250SM]
J6  HW-02-08-T-D-250-SM  [HW0208TD250SM]
J7  HW-02-08-T-D-250-SM  [HW0208TD250SM]
J8  HW-02-08-T-D-250-SM  [HW0208TD250SM]
Q1  IXYK110N120A4  [IXYK110N120A4]  (value not drawn)
Q2  IXYK110N120A4  [IXYK110N120A4]  (value not drawn)
Q3  IXYK110N120A4  [IXYK110N120A4]  (value not drawn)
Q4  IXYK110N120A4  [IXYK110N120A4]  (value not drawn)
R1#2  RCL12251K00FKEG  [RESC3263X80N]  (value not drawn)
R2#2  RCL12251K00FKEG  [RESC3263X80N]  (value not drawn)
R3#2  RCL12251K00FKEG  [RESC3263X80N]  (value not drawn)
R4#2  RCL12251K00FKEG  [RESC3263X80N]  (value not drawn)
R5#2  RCL12251K00FKEG  [RESC3263X80N]  (value not drawn)
R6#2  RCL12251K00FKEG  [RESC3263X80N]  (value not drawn)
R7#2  RCL12251K00FKEG  [RESC3263X80N]  (value not drawn)
R8#2  RCL12251K00FKEG  [RESC3263X80N]  (value not drawn)

### Blocks framed on the sheet
IGBT: J1 J3#2 J5 J7
IGBT: J2 J4 J6 J8

### Ports
COL, EM, MID

### Nets
H_COLLECTOR: BR1.1(K) BR3.1(K) BR5.1(K) BR7.1(K) J7.1 J7.2 J7.3 J7.4 Q1.2(C) Q3.2(C)
H_EMITTER: BR2.3(A) BR4.3(A) BR6.3(A) BR8.3(A) C2#2.2 J3#2.1 Q1.3(E) Q3.3(E) R3#2.2 R7#2.2 ; port MID
H_GATE_1: J5.1 J5.2 J5.3 J5.4 Q3.1(G)
H_GATE_2: J1.1 J1.2 J1.3 J1.4 Q1.1(G)
L_COLLECTOR: J8.1 J8.2 J8.3 J8.4 Q2.2(C)
L_EMITTER: C4#2.2 J4.1 Q2.3(E) Q4.3(E) ; port EM
L_GATE_1: J6.1 J6.2 J6.3 J6.4 Q4.1(G)
L_GATE_2: J2.1 J2.2 J2.3 J2.4 Q2.1(G)
NetBR1_3: BR1.3(A) BR3.3(A) BR5.3(A) BR7.3(A) R1#2.2 R5#2.2 ; port COL
NetBR2_1: BR2.1(K) BR4.1(K) BR6.1(K) BR8.1(K) Q4.2(C)
NetC1#2_1: C1#2.1 R2#2.1 R6#2.1
NetC1#2_2: C1#2.2 C2#2.1
NetC3#2_1: C3#2.1 R4#2.1 R8#2.1
NetC3#2_2: C3#2.2 C4#2.1
NetJ3#2_2: J3#2.2 J3#2.3 J3#2.4
NetJ4_2: J4.2 J4.3 J4.4
NetR1#2_1: R1#2.1 R2#2.2
NetR3#2_1: R3#2.1 R4#2.2
NetR5#2_1: R5#2.1 R6#2.2
NetR7#2_1: R7#2.1 R8#2.2

### Library data of the parts
BR1-BR8 = VS-75EPU12L-N3: Bridge Rectifier; Manufacturer_Name: Vishay; Datasheet Link: https://datasheet.lcsc.com/szlcsc/1811271814_Vishay-Intertech-VS-75EPU12L-N3_C335787.pdf; Height: 24.99mm; Manufacturer_Part_Number: VS-75EPU12L-N3; Mouser Part Number: 78-VS-75EPU12L-N3; Mouser Price/Stock: https://www.mouser.co.uk/ProductDetail/Vishay-Semiconductors/VS-75EPU12L-N3?qs=AfeIN4OqR0CECNyPZBJseQ%3D%3D; Arrow Part Number: VS-75EPU12L-N3; Arrow Price/Stock: https://www.arrow.com/en/products/vs-75epu12l-n3/vishay
C1#2 C2#2 C3#2 C4#2 = CMP-03020-010018-1: KC-LINK 3640 220NF 500V C0G; Manufacturer: KEMET; Manufacturer Part Number: CKC33C224KCGACAUTO; Material: Ceramic; Automotive Grade: Grade 0; Temperature Coefficient: 30ppm/°C; Tolerance: 0.1; RoHS: TRUE; ComponentLink2Description: Datasheet; Category: Cap; Temperature Range High: +150°C; Value: 0.22 uF; Ipc Land Pattern Name: CAPC9301020X250; Height: 2.7mm; Temperature Characteristic: C0G; Automotive: Yes; Device Class L1: Passive Components; Digikey Description: KC-LINK 3640 220NF 500V C0G; Temperature Range Low: -55°C; Lead Free: Yes; Device Class L2: Capacitors; ComponentLink2URL: https://content.kemet.com/datasheets/KEM_C1039_KC-LINK_C0G.pdf; Octopart: https://octopart.com/ckc33c224kcgacauto-kemet-88954723; Mouser Description: Cap Ceramic 0.22uF 500V C0G 10% Pad SMD 3640 150C Automotive T/R; Voltage Rating: 500V; Temperature: -55°C to +150°C; Device Class L3: Ceramic Capacitors; Package: CKC33C; Capacitance: 0.22 uF
J1 J2 J3#2 J4-J8 = HW-02-08-T-D-250-SM: Connector; Manufacturer_Name: SAMTEC; Datasheet Link: https://suddendocs.samtec.com/catalog_english/hw_sm.pdf; Height: 12.06mm; Manufacturer_Part_Number: HW-02-08-T-D-250-SM; Mouser Part Number: 200-HW0208TD250SM; Mouser Price/Stock: https://www.mouser.com/Search/Refine.aspx?Keyword=200-HW0208TD250SM; System: Connector
Q1-Q4 = IXYK110N120A4: Transistor IGBT; Manufacturer_Name: IXYS SEMICONDUCTOR; Datasheet Link: https://www.littelfuse.com/~/media/electronics/datasheets/discrete_igbts/littelfuse_discrete_igbts_xpt_ixyk110n120a4_datasheet.pdf.pdf; Height: 5.31mm; Manufacturer_Part_Number: IXYK110N120A4
R1#2 R2#2 R3#2 R4#2 R5#2 R6#2 R7#2 R8#2 = RCL12251K00FKEG: Resistor; Manufacturer_Name: Vishay; Datasheet Link: https://www.mouser.com/datasheet/2/427/rcle3-247384.pdf; Height: 0.8mm; Manufacturer_Part_Number: RCL12251K00FKEG; Mouser Part Number: 71-RCL12251K00FKEG; Mouser Price/Stock: https://www.mouser.com/Search/Refine.aspx?Keyword=71-RCL12251K00FKEG

## Sheet HV_Bus.SchDoc
size A4

## Sheet Phase_Capacitor.SchDoc
size A3
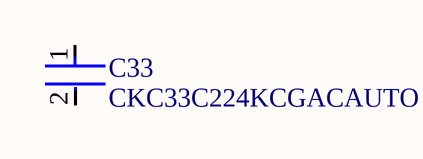
[diagram p4: Phase_Capacitor.SchDoc]

### Parts
C33  CKC33C224KCGACAUTO  [FP-CKC33C-IPC_A]

### Nets

Not connected (* = marked no-connect by the designer): C33 1 2

### Library data of the parts
C33 = CMP-03020-010018-1: KC-LINK 3640 220NF 500V C0G; Manufacturer: KEMET; Value: 0.22 uF; Material: Ceramic; Automotive Grade: Grade 0; Temperature Coefficient: 30ppm/°C; Tolerance: 0.1; RoHS: TRUE; ComponentLink2Description: Datasheet; Category: Cap; Temperature Range High: +150°C; Ipc Land Pattern Name: CAPC9301020X250; Height: 2.7mm; Temperature Characteristic: C0G; Automotive: Yes; Device Class L1: Passive Components; Digikey Description: KC-LINK 3640 220NF 500V C0G; Temperature Range Low: -55°C; Lead Free: Yes; Manufacturer Part Number: CKC33C224KCGACAUTO; Device Class L2: Capacitors; ComponentLink2URL: https://content.kemet.com/datasheets/KEM_C1039_KC-LINK_C0G.pdf; Octopart: https://octopart.com/ckc33c224kcgacauto-kemet-88954723; Mouser Description: Cap Ceramic 0.22uF 500V C0G 10% Pad SMD 3640 150C Automotive T/R; Voltage Rating: 500V; Temperature: -55°C to +150°C; Device Class L3: Ceramic Capacitors; Package: CKC33C; Capacitance: 0.22 uF

## Nets that join several sheets
+18V_H: Isolated_Gate_DCDC (P?#1.1), Gate_Drive (11 pins)
+18V_L: Isolated_Gate_DCDC (P?#3.1), Gate_Drive (11 pins)
-7V_H: Isolated_Gate_DCDC (P?#1.3), Gate_Drive (9 pins)
-7V_L: Isolated_Gate_DCDC (P?#3.3), Gate_Drive (9 pins)
GND_H: Isolated_Gate_DCDC (P?#2.2), Gate_Drive (11 pins), Control_Unit (J?#1.4 J?#2.4 J?#3.4)
GND_L: Isolated_Gate_DCDC (P?#4.2), Gate_Drive (11 pins), Control_Unit (J?#1.13 J?#2.13 J?#3.13)
H_EMITTER: Isolated_Gate_DCDC (P?#1.2), Gate_Drive (20 pins)
H_VCC: Gate_Drive (18 pins), Control_Unit (6 pins)
L_EMITTER: Isolated_Gate_DCDC (P?#3.2), Gate_Drive (20 pins)